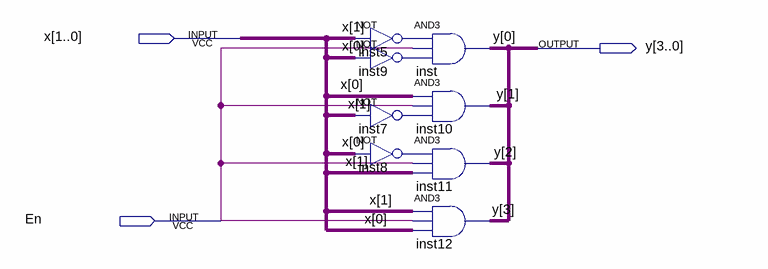
[diagram p0: schematic sheet]
// Quartus schematic DecoderDemo3.bdf as structural Verilog: 8 symbols, 3 pins
module DecoderDemo3 (
  input  [1:0] x,
  input  En,
  output [3:0] y
);

  wire inst5_out, inst7_out, inst8_out, inst9_out;

  not inst5 (inst5_out, x[1]);
  not inst9 (inst9_out, x[0]);
  not inst7 (inst7_out, x[1]);
  not inst8 (inst8_out, x[0]);
  and inst (y[0], inst5_out, En, inst9_out);
  and inst10 (y[1], x[0], En, inst7_out);
  and inst11 (y[2], inst8_out, En, x[1]);
  and inst12 (y[3], x[1], En, x[0]);
endmodule
